# Altium schematic sheet HAT_ID01_OLED.SchDoc
size A3; PageSetup: Record=PageOptions|CenterHorizontal=True|CenterVertical=True|PrintScale=0.71|XCorrection=1.00|YCorrection=1.00|PrintKind=1|BorderSize=5000000|LeftOffset=0|BottomOffset=0|Orientation=2|PaperLength=1000|PaperWidth=1000|Scale=100|PaperSource=7|PrintQuality=600|MediaType=1|DitherType=10|PrintScaleMode=1|PaperKind=A4 (210 x 297mm)|PaperIndex=9
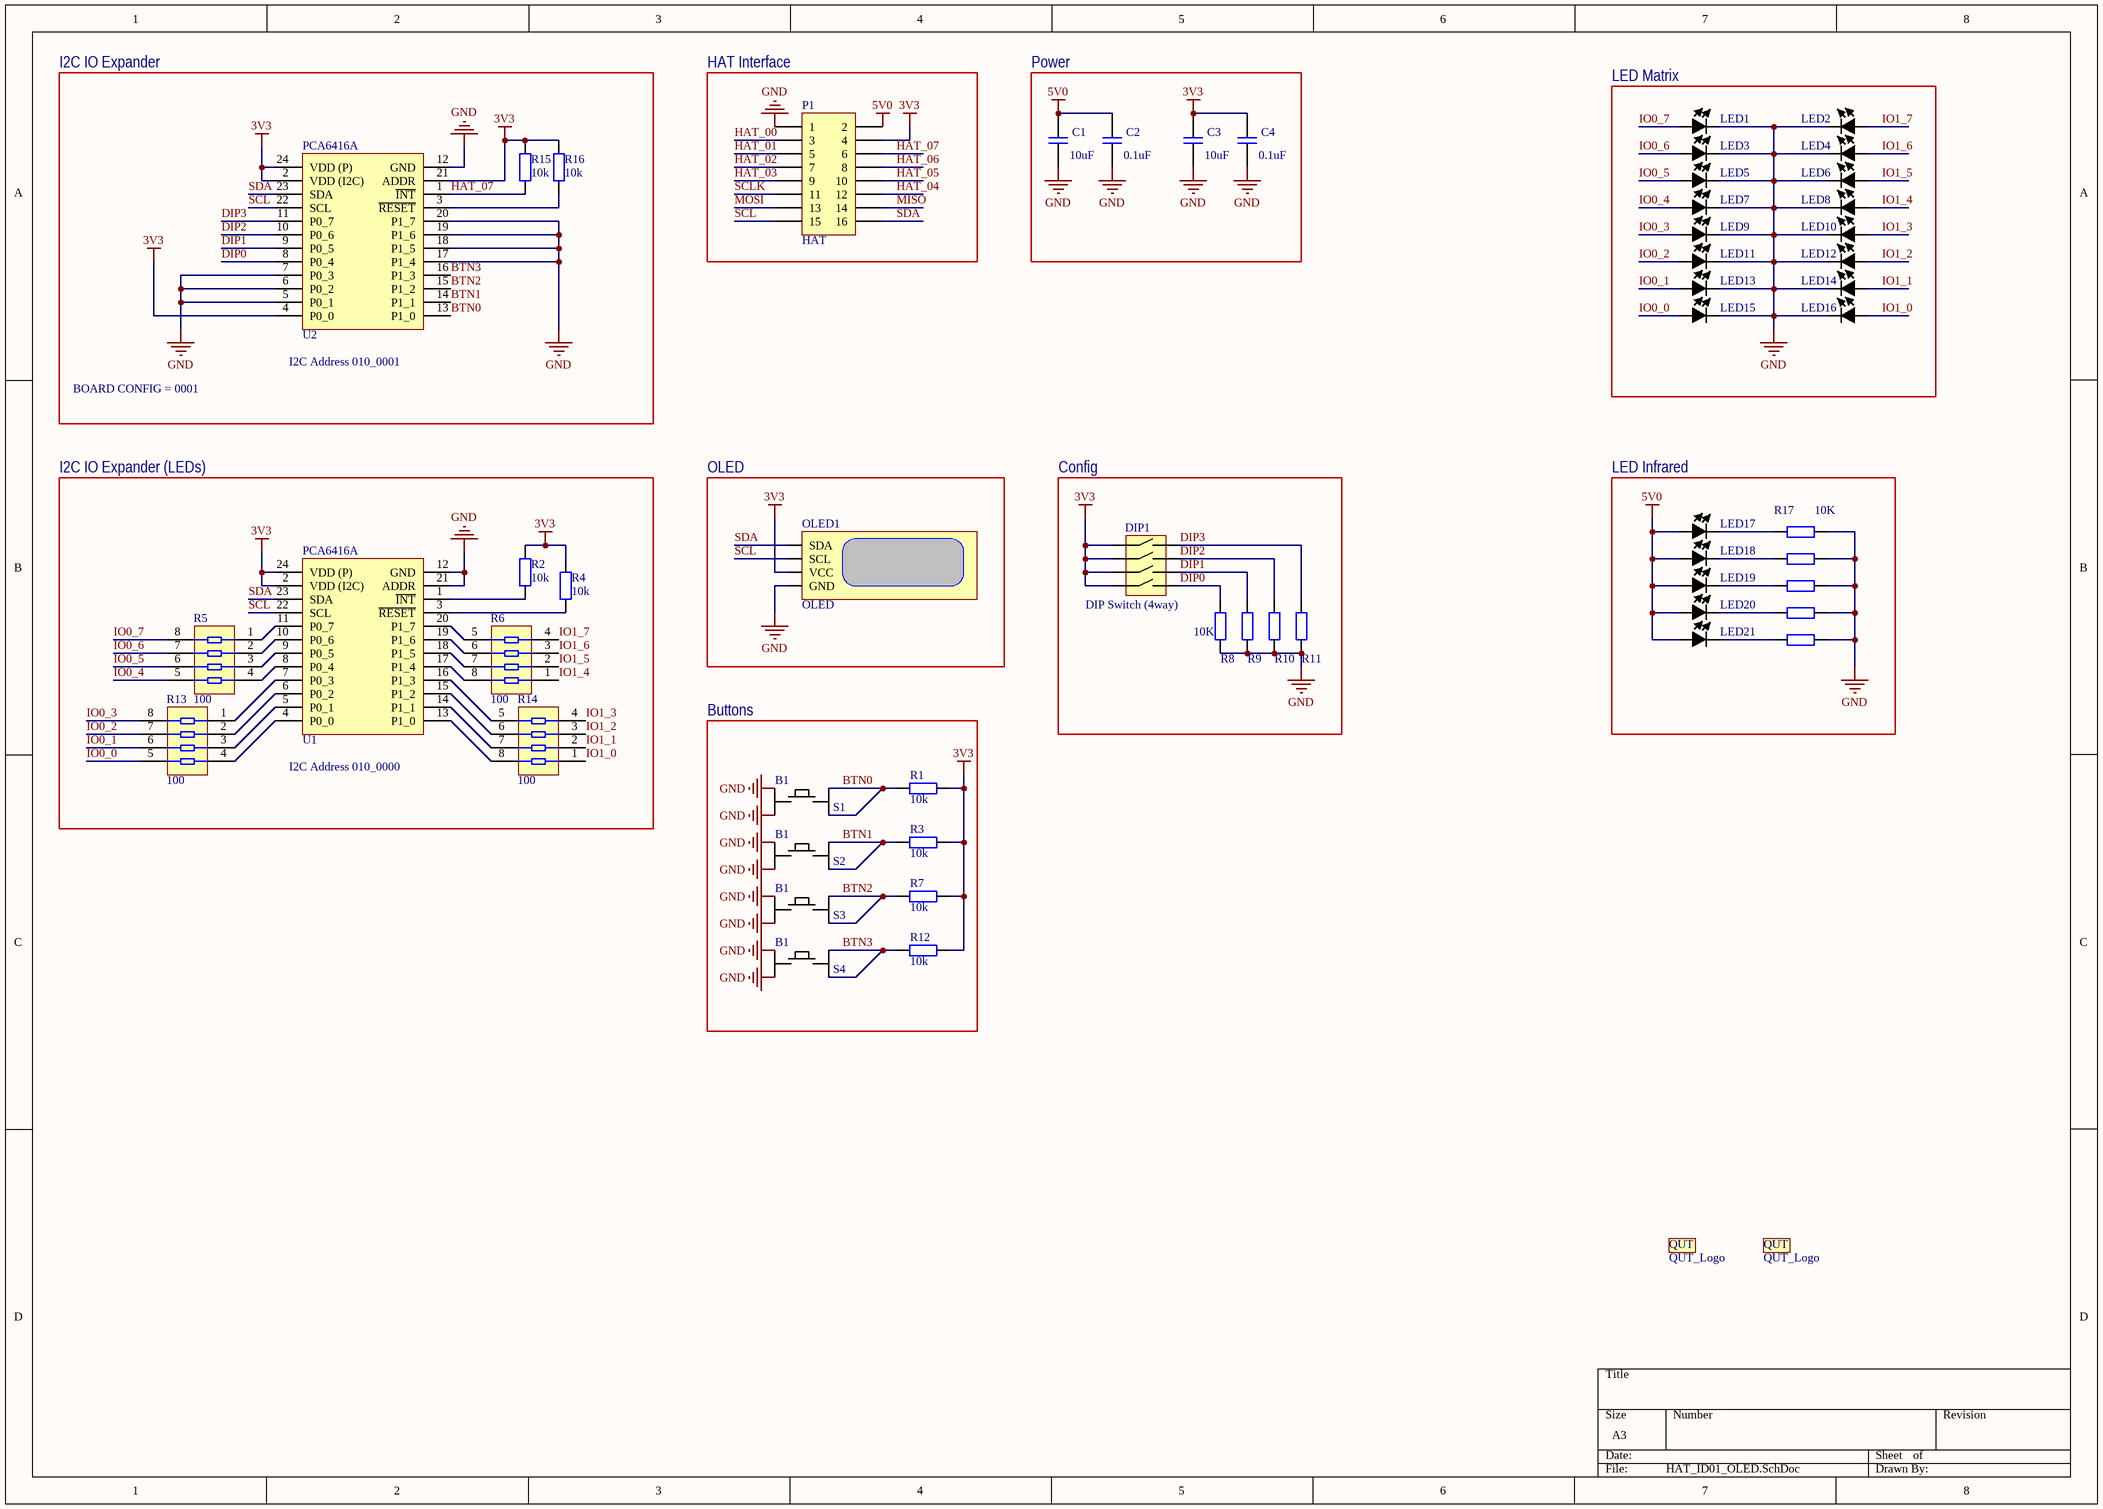
[diagram p0: HAT_ID01_OLED.SchDoc]

## Parts
C1  value 10uF  [C0805]  (hidden comment: CAP SMD)
C2  value 0.1uF  [C0805]  (hidden comment: CAP SMD)
C3  value 10uF  [C0805]  (hidden comment: CAP SMD)
C4  value 0.1uF  [C0805]  (hidden comment: CAP SMD)
DIP1  DIP Switch (4way)  [DIP SMD]
LED1  LED*  [C0805]  (value not drawn)
LED2  LED*  [C0805]  (value not drawn)
LED3  LED*  [C0805]  (value not drawn)
LED4  LED*  [C0805]  (value not drawn)
LED5  LED*  [C0805]  (value not drawn)
LED6  LED*  [C0805]  (value not drawn)
LED7  LED*  [C0805]  (value not drawn)
LED8  LED*  [C0805]  (value not drawn)
LED9  LED*  [C0805]  (value not drawn)
LED10  LED*  [C0805]  (value not drawn)
LED11  LED*  [C0805]  (value not drawn)
LED12  LED*  [C0805]  (value not drawn)
LED13  LED*  [C0805]  (value not drawn)
LED14  LED*  [C0805]  (value not drawn)
LED15  LED*  [C0805]  (value not drawn)
LED16  LED*  [C0805]  (value not drawn)
LED17  LED*  [C0805]  (value not drawn)
LED18  LED*  [C0805]  (value not drawn)
LED19  LED*  [C0805]  (value not drawn)
LED20  LED*  [C0805]  (value not drawn)
LED21  LED*  [C0805]  (value not drawn)
LG1  QUT_Logo  [QUT_Logo]  (no BOM)
LG2  QUT_Logo  [QUT_Logo]  (no BOM)
OLED1  OLED  [OLED]
P1  HAT  [HDR2X8]
R1  value 10k  [RESC2012X07N]  (hidden comment: RES SMD)
R2  value 10k  [RESC2012X07N]  (hidden comment: RES SMD)
R3  value 10k  [RESC2012X07N]  (hidden comment: RES SMD)
R4  value 10k  [RESC2012X07N]  (hidden comment: RES SMD)
R5  value 100  [CAC-80P319X155-8M]  (hidden comment: ARRAY)
R6  value 100  [CAC-80P319X155-8M]  (hidden comment: ARRAY)
R7  value 10k  [RESC2012X07N]  (hidden comment: RES SMD)
R8  value 10K  [RESC2012X07N]  (hidden comment: RES SMD)
R9  RES SMD  [RESC2012X07N]  (value not drawn)
R10  RES SMD  [RESC2012X07N]  (value not drawn)
R11  RES SMD  [RESC2012X07N]  (value not drawn)
R12  value 10k  [RESC2012X07N]  (hidden comment: RES SMD)
R13  value 100  [CAC-80P319X155-8M]  (hidden comment: ARRAY)
R14  value 100  [CAC-80P319X155-8M]  (hidden comment: ARRAY)
R15  value 10k  [RESC2012X07N]  (hidden comment: RES SMD)
R16  value 10k  [RESC2012X07N]  (hidden comment: RES SMD)
R17  value 10K  [RESC2012X07N]  (hidden comment: RES SMD)
R18  RES SMD  [RESC2012X07N]  (value not drawn)
R19  RES SMD  [RESC2012X07N]  (value not drawn)
R20  RES SMD  [RESC2012X07N]  (value not drawn)
R21  RES SMD  [RESC2012X07N]  (value not drawn)
S1  B1  [E-SWITCH-TL3342]
S2  B1  [E-SWITCH-TL3342]
S3  B1  [E-SWITCH-TL3342]
S4  B1  [E-SWITCH-TL3342]
U1  PCA6416A  [TSOP65P640X110-24N]
U2  PCA6416A  [TSOP65P640X110-24N]

## Blocks framed on the sheet
I2C IO Expander: R15 R16 U2
HAT Interface: P1
Power: C1-C4
LED Matrix: LED1-LED16
I2C IO Expander (LEDs): R2 R4-R6 R13 R14 U1
OLED: OLED1
Config: DIP1 R8-R11
LED Infrared: LED17-LED21 R17-R21
Buttons: R1 R3 R7 R12 S1-S4

## Nets
3V3: C3.2(K) C4.2(K) DIP1.0 DIP1.1 DIP1.2 DIP1.3 OLED1.2(VCC) P1.4 R1.1 R2.2 R3.1 R4.2 R7.1 R12.1 R15.2 R16.2 U1.2(VDD_(I2C)) U1.24(VDD_(P)) U2.2(VDD_(I2C)) U2.4(P0_0) U2.21(ADDR) U2.24(VDD_(P))
5V0: C1.2(K) C2.2(K) LED17.1 LED18.1 LED19.1 LED20.1 LED21.1 P1.2
GND: C1.1(A) C2.1(A) C3.1(A) C4.1(A) LED1.2 LED2.2 LED3.2 LED4.2 LED5.2 LED6.2 LED7.2 LED8.2 LED9.2 LED10.2 LED11.2 LED12.2 LED13.2 LED14.2 LED15.2 LED16.2 OLED1.1(GND) P1.1 R8.1 R9.1 R10.1 R11.1 R17.1 R18.1 R19.1 R20.1 R21.1 S1.1(A) S1.2(A') S2.1(A) S2.2(A') S3.1(A) S3.2(A') S4.1(A) S4.2(A') U1.12(GND) U1.21(ADDR) U2.5(P0_1) U2.6(P0_2) U2.7(P0_3) U2.12(GND) U2.17(P1_4) U2.18(P1_5) U2.19(P1_6) U2.20(P1_7)
BTN0: R1.2 S1.3(B') S1.4(B) U2.13(P1_0)
BTN1: R3.2 S2.3(B') S2.4(B) U2.14(P1_1)
BTN2: R7.2 S3.3(B') S3.4(B) U2.15(P1_2)
BTN3: R12.2 S4.3(B') S4.4(B) U2.16(P1_3)
DIP0: DIP1.4 R8.2 U2.8(P0_4)
DIP1: DIP1.5 R9.2 U2.9(P0_5)
DIP2: DIP1.6 R10.2 U2.10(P0_6)
DIP3: DIP1.7 R11.2 U2.11(P0_7)
HAT_00: P1.3
HAT_01: P1.5
HAT_02: P1.7
HAT_03: P1.9
HAT_04: P1.12
HAT_05: P1.10
HAT_06: P1.8
HAT_07: P1.6 R15.1 U2.1(~{INT})
IO0_0: LED15.1 R13.5
IO0_1: LED13.1 R13.6
IO0_2: LED11.1 R13.7
IO0_3: LED9.1 R13.8
IO0_4: LED7.1 R5.5
IO0_5: LED5.1 R5.6
IO0_6: LED3.1 R5.7
IO0_7: LED1.1 R5.8
IO1_0: LED16.1 R14.1
IO1_1: LED14.1 R14.2
IO1_2: LED12.1 R14.3
IO1_3: LED10.1 R14.4
IO1_4: LED8.1 R6.1
IO1_5: LED6.1 R6.2
IO1_6: LED4.1 R6.3
IO1_7: LED2.1 R6.4
MISO: P1.14
MOSI: P1.13
SCL: OLED1.3(SCL) P1.15 U1.22(SCL) U2.22(SCL)
SCLK: P1.11
SDA: OLED1.4(SDA) P1.16 U1.23(SDA) U2.23(SDA)
NetLED17_2: LED17.2 R17.2
NetLED18_2: LED18.2 R18.2
NetLED19_2: LED19.2 R19.2
NetLED20_2: LED20.2 R20.2
NetLED21_2: LED21.2 R21.2
NetR2_1: R2.1 U1.1(~{INT})
NetR4_1: R4.1 U1.3(~{RESET})
NetR5_1: R5.1 U1.11(P0_7)
NetR5_2: R5.2 U1.10(P0_6)
NetR5_3: R5.3 U1.9(P0_5)
NetR5_4: R5.4 U1.8(P0_4)
NetR6_5: R6.5 U1.20(P1_7)
NetR6_6: R6.6 U1.19(P1_6)
NetR6_7: R6.7 U1.18(P1_5)
NetR6_8: R6.8 U1.17(P1_4)
NetR13_1: R13.1 U1.7(P0_3)
NetR13_2: R13.2 U1.6(P0_2)
NetR13_3: R13.3 U1.5(P0_1)
NetR13_4: R13.4 U1.4(P0_0)
NetR14_5: R14.5 U1.16(P1_3)
NetR14_6: R14.6 U1.15(P1_2)
NetR14_7: R14.7 U1.14(P1_1)
NetR14_8: R14.8 U1.13(P1_0)
NetR16_1: R16.1 U2.3(~{RESET})

## Notes on the sheet
- (near U2) I2C Address 010_0001
- BOARD CONFIG = 0001
- (near U1) I2C Address 010_0000
- (in symbol QUT_Logo) QUT

## Library data of the parts
C1-C4 = CAP SMD: Surface mount capacitor
LED1-LED21 = LED: Supplier: E14 1716764
P1 = Header 8X2: Header, 8-Pin, Dual row; LatestRevisionDate: 17-Jul-2002; LatestRevisionNote: Re-released for DXP Platform.; Publisher: Altium Limited
R1-R4 R7 R8 R12 R15-R17 = RES SMD: 0805 surface mount resistor
R5 R6 R13 R14 = RES-ARRAY: Surface mount resistor array
R9-R11 R18-R21 = RES SMD: 0805 surface mount resistor; Value: 10K
S1-S4 = E-SWITCH-PUSHBUTTON: TL 3342 surface mount pushbutton
U1 U2 = PCA6416APW: Low-voltage translating 16-bit I2C I/O port expander